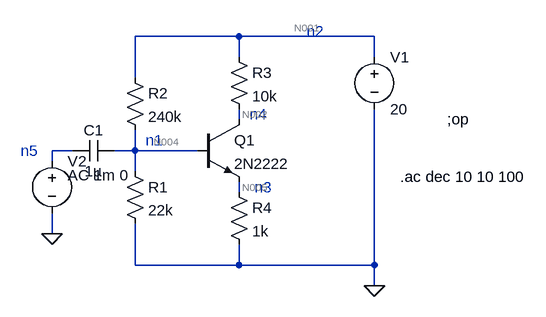
[diagram p0: schematic test circuit 1.asc]
test circuit 1.asc, the LTspice schematic file:
Version 4
SHEET 1 916 680
WIRE 448 160 288 160
WIRE 656 160 448 160
WIRE 448 192 448 160
WIRE 656 192 656 160
WIRE 288 224 288 160
WIRE 448 288 448 272
WIRE 192 336 160 336
WIRE 288 336 288 304
WIRE 288 336 256 336
WIRE 384 336 288 336
WIRE 160 352 160 336
WIRE 288 368 288 336
WIRE 448 400 448 384
WIRE 160 464 160 432
WIRE 288 512 288 448
WIRE 448 512 448 480
WIRE 448 512 288 512
WIRE 656 512 656 272
WIRE 656 512 448 512
WIRE 656 544 656 512
FLAG 656 544 0
FLAG 160 464 0
DATAFLAG 464 160 "$"
SYMBOL res 272 352 R0
SYMATTR InstName R1
SYMATTR Value 22k
SYMBOL res 272 208 R0
SYMATTR InstName R2
SYMATTR Value 240k
SYMBOL res 432 176 R0
SYMATTR InstName R3
SYMATTR Value 10k
SYMBOL npn 384 288 R0
SYMATTR InstName Q1
SYMATTR Value 2N2222
SYMBOL res 432 384 R0
SYMATTR InstName R4
SYMATTR Value 1k
SYMBOL voltage 656 176 R0
SYMATTR InstName V1
SYMATTR Value 20
SYMBOL voltage 160 336 R0
WINDOW 123 24 38 Left 2
SYMATTR Value2 AC 1m 0
SYMATTR InstName V2
SYMATTR Value ""
SYMBOL cap 256 320 R90
WINDOW 0 0 32 VBottom 2
WINDOW 3 32 32 VTop 2
SYMATTR InstName C1
SYMATTR Value 1µ
TEXT 768 288 Left 2 !;op
TEXT 696 376 Left 2 !.ac dec 10 10 100
TEXT 112 336 Left 2 ;n5
TEXT 464 280 Left 2 ;n4
TEXT 472 392 Left 2 ;n3
TEXT 552 152 Left 2 ;n2
TEXT 304 320 Left 2 ;n1

The netlist it stands for:
* test circuit 1.asc
R1 N004 0 22k
R2 N001 N004 240k
R3 N001 N002 10k
Q1 N002 N004 N005 0 2N2222
R4 N005 0 1k
V1 N001 0 20
V2 N003 0 AC 1m 0
C1 N004 N003 1µ
.model NPN NPN
.model PNP PNP
.lib standard.bjt
;op
.ac dec 10 10 100
* n5
* n4
* n3
* n2
* n1
.backanno
.end

* Results of the author's LTspice run, read from the files saved beside the schematic
* Operating Point, zero values left out:
*   V(n004) = 1.593 V
*   V(n001) = 20 V
*   V(n002) = 10.63 V
*   V(n005) = 941.1 mV
*   Ic(Q1) = 936.8 µA
*   Ib(Q1) = 4.308 µA
*   Ie(Q1) = -941.1 µA
*   I(R4) = 941.1 µA
*   I(R3) = 936.8 µA
*   I(R2) = 76.7 µA
*   I(R1) = 72.39 µA
*   I(V1) = -1.013 mA
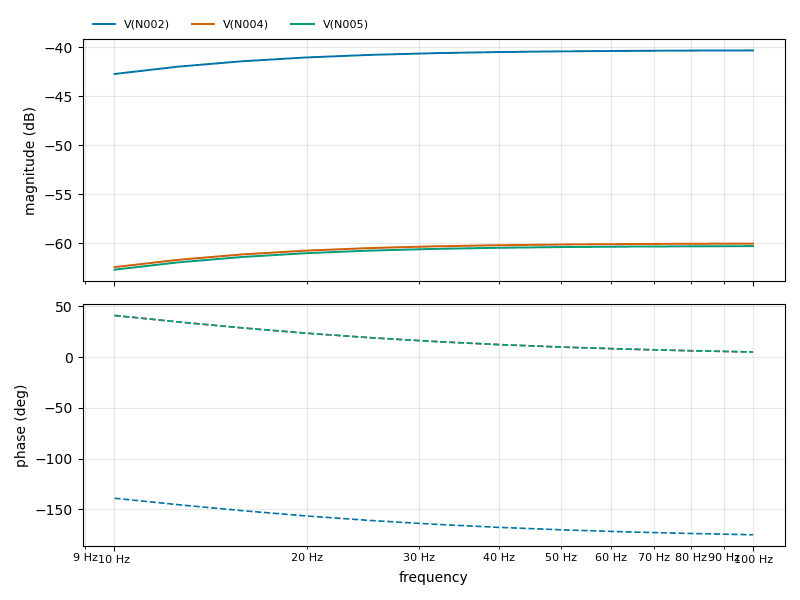
[diagram p1: AC Analysis of test circuit 1.asc, plotted from the saved traces]
* AC Analysis, 1 run:
*   V(N002): -42.74 dB at 10 Hz, -40.34 dB at 100 Hz, peak -40.34 dB at 100 Hz
*   V(N004): -62.44 dB at 10 Hz, -60.03 dB at 100 Hz, peak -60.03 dB at 100 Hz
*   V(N005): -62.70 dB at 10 Hz, -60.29 dB at 100 Hz, peak -60.29 dB at 100 Hz